# EAGLE design Adafruit RGB Matrix Shield (EAGLE 9.0.1)
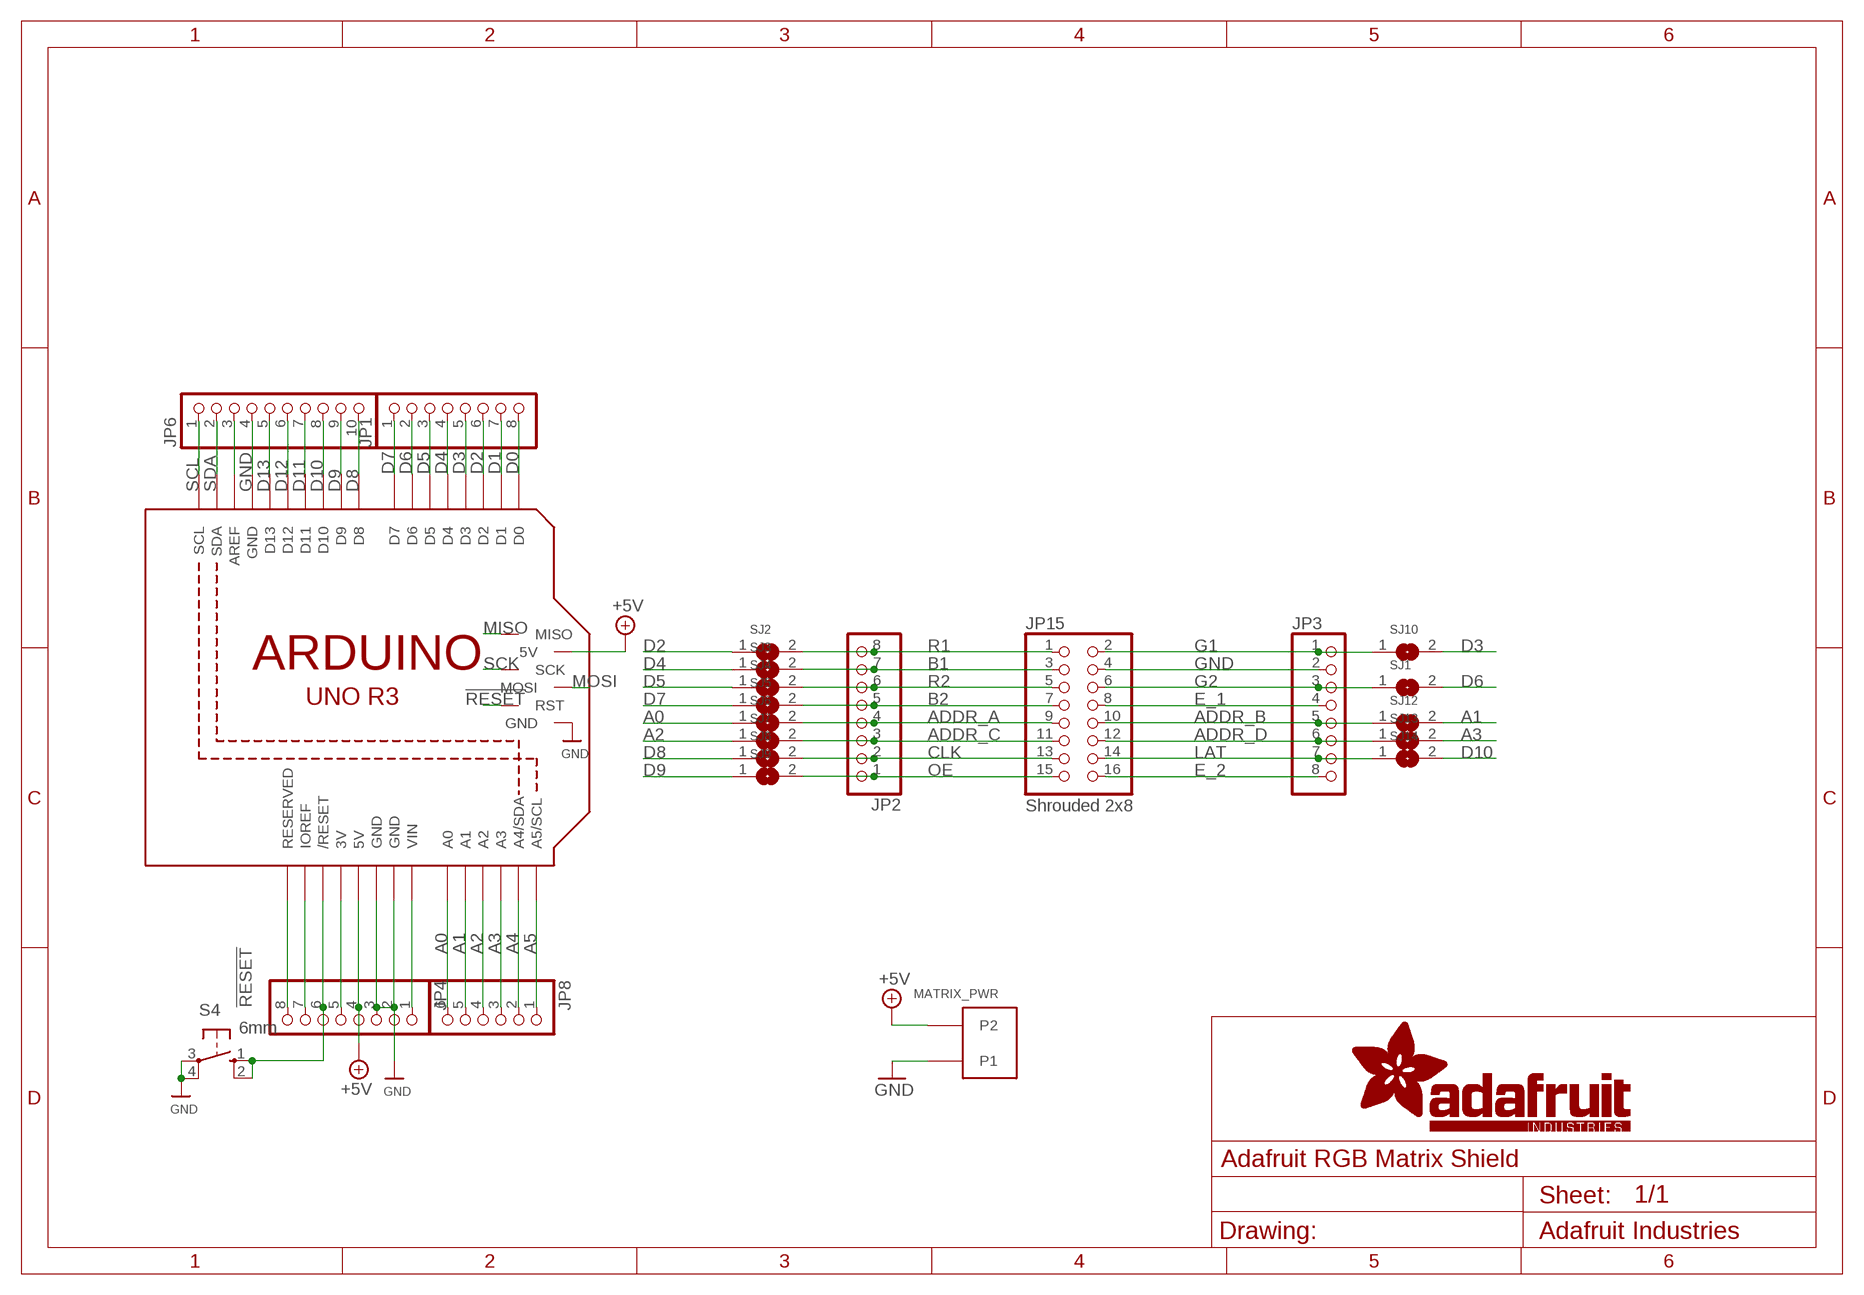
[diagram p0: schematic, sheet 1]

## Parts
JP1  PINHD-1X8CLEANBIG  [1X08-CLEANBIG]
JP2  HEADER-1X876MIL  [1X08_ROUND_76]
JP3  HEADER-1X876MIL  [1X08_ROUND_76]
JP4  PINHD-1X8CLEANBIG  [1X08-CLEANBIG]
JP6  HEADER-1X1070MIL  [1X10_ROUND70]
JP8  PINHD-1X6CB  [1X06-CLEANBIG]
JP15  Shrouded 2x8  HEADER-2X8_SHROUDED  [2X08_SHROUDED]
MATRIX_PWR  PINHEAD  [TERMBLOCK508]
S4  6mm  10-XX  [B3F-10XX]
SJ1  SOLDERJUMPERCLOSED  [SOLDERJUMPER_CLOSEDWIRE]
SJ2  SOLDERJUMPERCLOSED  [SOLDERJUMPER_CLOSEDWIRE]
SJ3  SOLDERJUMPERCLOSED  [SOLDERJUMPER_CLOSEDWIRE]
SJ4  SOLDERJUMPERCLOSED  [SOLDERJUMPER_CLOSEDWIRE]
SJ5  SOLDERJUMPERCLOSED  [SOLDERJUMPER_CLOSEDWIRE]
SJ6  SOLDERJUMPERCLOSED  [SOLDERJUMPER_CLOSEDWIRE]
SJ7  SOLDERJUMPERCLOSED  [SOLDERJUMPER_CLOSEDWIRE]
SJ8  SOLDERJUMPERCLOSED  [SOLDERJUMPER_CLOSEDWIRE]
SJ9  SOLDERJUMPERCLOSED  [SOLDERJUMPER_CLOSEDWIRE]
SJ10  SOLDERJUMPERCLOSED  [SOLDERJUMPER_CLOSEDWIRE]
SJ12  SOLDERJUMPERCLOSED  [SOLDERJUMPER_CLOSEDWIRE]
SJ13  SOLDERJUMPERCLOSED  [SOLDERJUMPER_CLOSEDWIRE]
SJ14  SOLDERJUMPERCLOSED  [SOLDERJUMPER_CLOSEDWIRE]
U$41  ARDUINO_R3_ICSP_NODIM  [ARDUINOR3_ICSP_NODIM]

## Nets
!RESET: JP4.6 S4.1(S) S4.2(S1) U$41.RESET(/RESET) U$41.RESET_ICSP(RST)
+3V: JP4.5 U$41.3V
+5V: JP4.4 MATRIX_PWR.P$4(P2) U$41.5V U$41.5V_ICSP(5V)
A0: JP8.6 SJ6.1 U$41.A0
A1: JP8.5 SJ12.2 U$41.A1
A2: JP8.4 SJ7.1 U$41.A2
A3: JP8.3 SJ13.2 U$41.A3
A4: JP8.2 U$41.A4(A4/SDA)
A5: JP8.1 U$41.A5(A5/SCL)
ADDR_A: JP2.4 JP15.9 SJ6.2
ADDR_B: JP3.5 JP15.10 SJ12.1
ADDR_C: JP2.3 JP15.11 SJ7.2
ADDR_D: JP3.6 JP15.12 SJ13.1
AREF: JP6.3 U$41.AREF
B1: JP2.7 JP15.3 SJ3.2
B2: JP2.5 JP15.7 SJ5.2
CLK: JP2.2 JP15.13 SJ8.2
D0: JP1.8 U$41.D0
D1: JP1.7 U$41.D1
D2: JP1.6 SJ2.1 U$41.D2
D3: JP1.5 SJ10.2 U$41.D3
D4: JP1.4 SJ3.1 U$41.D4
D5: JP1.3 SJ4.1 U$41.D5
D6: JP1.2 SJ1.2 U$41.D6
D7: JP1.1 SJ5.1 U$41.D7
D8: JP6.10 SJ8.1 U$41.D8
D9: JP6.9 SJ9.1 U$41.D9
D10: JP6.8 SJ14.2 U$41.D10
D11: JP6.7 U$41.D11
D12: JP6.6 U$41.D12
D13: JP6.5 U$41.D13
E_1: JP3.4 JP15.8
E_2: JP3.8 JP15.16
G1: JP3.1 JP15.2 SJ10.1
G2: JP3.3 JP15.6 SJ1.1
GND: JP3.2 JP4.2 JP4.3 JP6.4 JP15.4 MATRIX_PWR.P$3(P1) S4.3(P) S4.4(P1) U$41.GND U$41.GND@1(GND) U$41.GND@2(GND) U$41.GND@3(GND)
IOREF: JP4.7 U$41.IOREF
LAT: JP3.7 JP15.14 SJ14.1
MISO: U$41.MISO
MOSI: U$41.MOSI
NC: JP4.8 U$41.RESERVED
OE: JP2.1 JP15.15 SJ9.2
R1: JP2.8 JP15.1 SJ2.2
R2: JP2.6 JP15.5 SJ4.2
SCK: U$41.SCK
SCL: JP6.1 U$41.SCL
SDA: JP6.2 U$41.SDA
VIN: JP4.1 U$41.VIN

## Library data of the parts
JP1 JP4 = adafruit:PINHD-1X8: PIN HEADER
JP2 JP3 = microbuilder:HEADER-1X8: PIN HEADER
JP6 = microbuilder:HEADER-1X10: PIN HEADER
JP8 = adafruit:PINHD-1X6: PIN HEADER
JP15 = microbuilder:HEADER-2X8
MATRIX_PWR = mshield:PINHEAD
S4 = switch-omron:10-XX: OMRON SWITCH; MPN: B3F-1000; OC_FARNELL: 176432; OC_NEWARK: 36M3542
SJ1-SJ10 SJ12-SJ14 = microbuilder:SOLDERJUMPER: SMD Solder JUMPER Solder the two pads together to create a connection, or remove the solder to break it. REFLOW - Use this footprint for solder paste and reflow ovens. WAVE - Use this footprint for hand-soldering (larger pads). CLOSED - Has a trace between the two pads to ensure it is closed by default. The trace needs to be cut to disable the jumper, and can be closed again by creating a solder bridge between the two pads.
U$41 = adafruit:ARDUINO_R3_ICSP

## Board
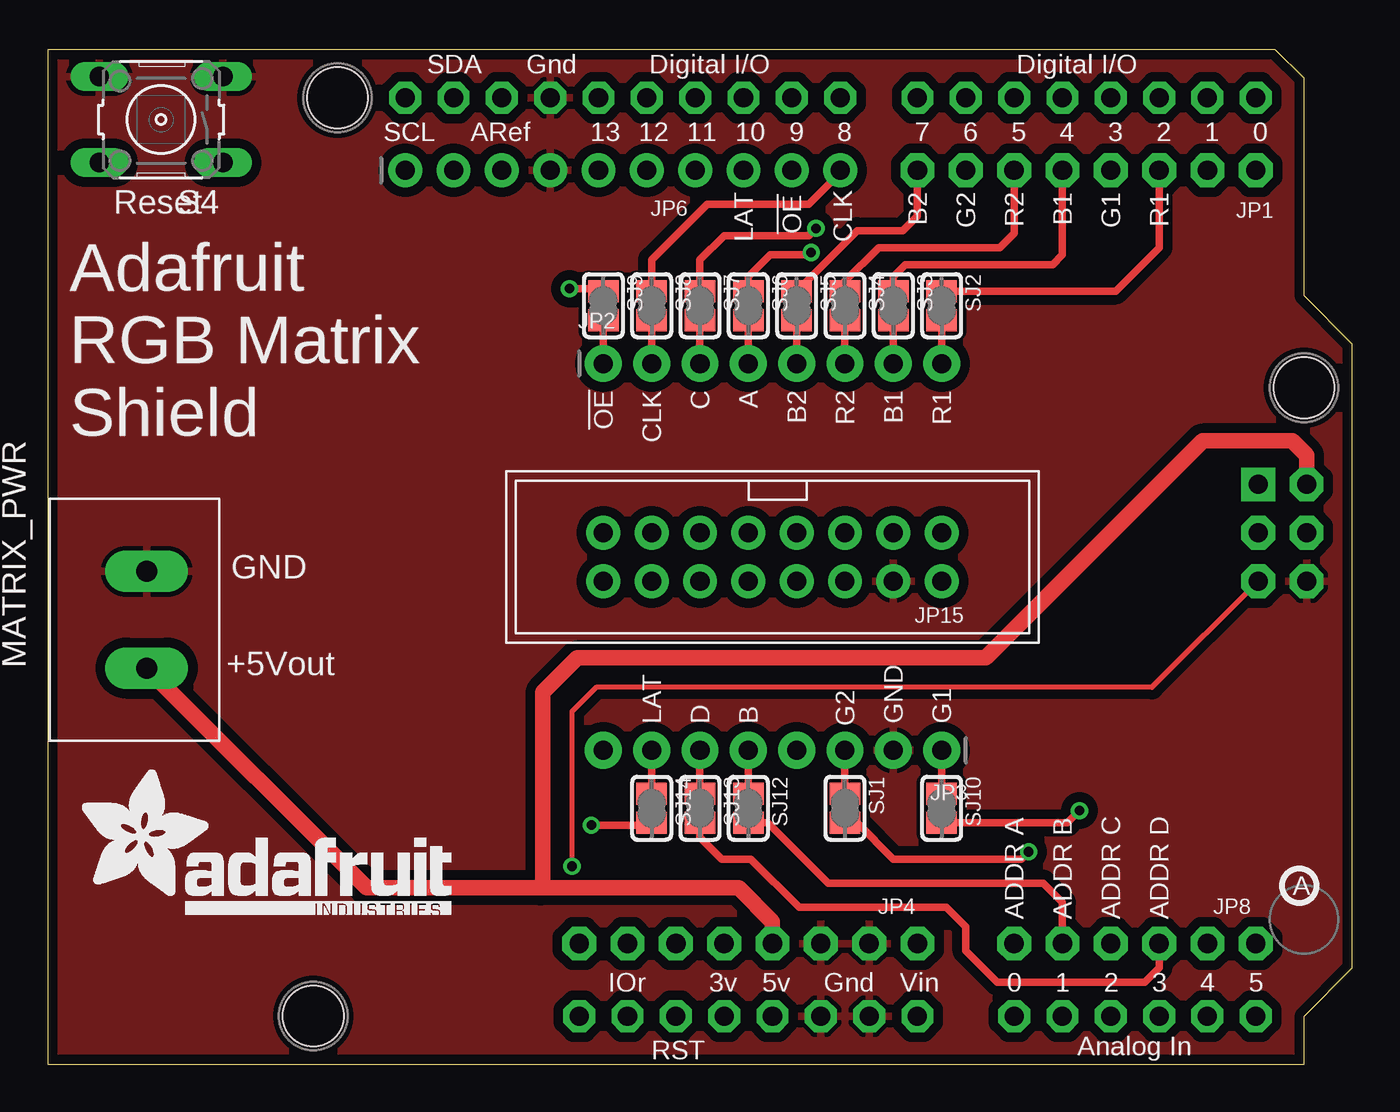
[diagram p1: board, top side]
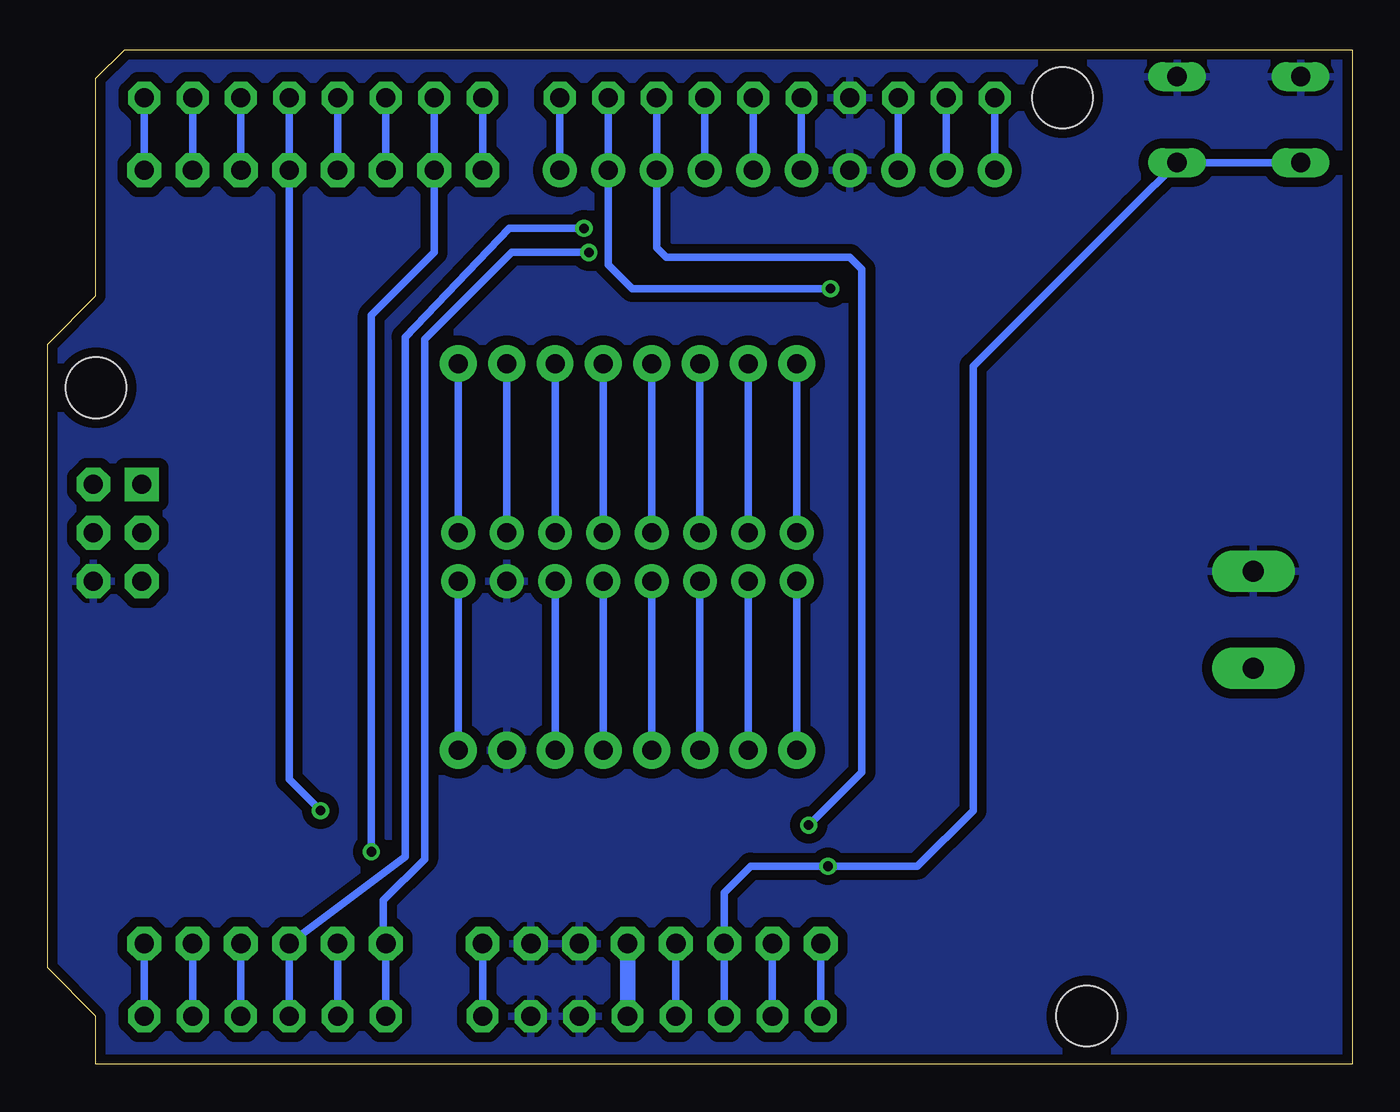
[diagram p2: board, bottom side, seen from below]

Size 68.58 x 53.34 mm. Coordinates in mm from the lower left corner, seen from the top.
Outline: 0,0 66.04,0 66.04,2.54 68.58,5.08 68.58,37.85 66.04,40.39 66.04,51.82 64.52,53.34 0,53.34 0,0
Copper layers (1*16): Top 0.035mm / dielectric 1.5mm / Bottom 0.035mm
Design rules "adafruit *": minimum track width 7mil, minimum drill 15.5mil, track to track 7mil, track to pad 7mil, pad to pad 7mil, via to via 7mil, smd to smd 7mil, copper to edge 10mil, drill to drill 8mil, minimum pad ring 10mil, minimum via ring 8mil, stop-mask expansion 2mil, vias tented up to drill 20mil, thermal gap 10mil
Holes 3.2 mm at 15.24,50.8 13.97,2.54 66.04,35.56

### Footprints (pad centres in the part's own frame; a part is rotated, then mirrored left to right if it is on the bottom)
1X08-CLEANBIG = drill 1.016 pad 1.778 octagon: 1 -8.89,0; 2 -6.35,0; 3 -3.81,0; 4 -1.27,0; 5 1.27,0; 6 3.81,0; 7 6.35,0; 8 8.89,0
1X08_ROUND_76 = drill 1 pad 1.93: 1 -8.89,0; 2 -6.35,0; 3 -3.81,0; 4 -1.27,0; 5 1.27,0; 6 3.81,0; 7 6.35,0; 8 8.89,0
1X10_ROUND70 = drill 1 pad 1.778: 1 -11.43,0; 2 -8.89,0; 3 -6.35,0; 4 -3.81,0; 5 -1.27,0; 6 1.27,0; 7 3.81,0; 8 6.35,0; 9 8.89,0; 10 11.43,0
1X06-CLEANBIG = drill 1.016 pad 1.778 octagon: 1 -6.35,0; 2 -3.81,0; 3 -1.27,0; 4 1.27,0; 5 3.81,0; 6 6.35,0
2X08_SHROUDED = drill 1 pad 1.778: 1 -8.89,-1.27; 2 -8.89,1.27; 3 -6.35,-1.27; 4 -6.35,1.27; 5 -3.81,-1.27; 6 -3.81,1.27; 7 -1.27,-1.27; 8 -1.27,1.27; 9 1.27,-1.27; 10 1.27,1.27; 11 3.81,-1.27; 12 3.81,1.27; 13 6.35,-1.27; 14 6.35,1.27; 15 8.89,-1.27; 16 8.89,1.27
TERMBLOCK508 = drill 1.1 pad 2.184 long: P$3 -2.54,0; P$4 2.54,0
B3F-10XX = drill 1.016 long: 1 -3.251,2.261; 2 3.251,2.261; 3 -3.251,-2.261; 4 3.251,-2.261
SOLDERJUMPER_CLOSEDWIRE = smd 1.168 x 1.6: 1 -0.762,0; 2 0.762,0 | smd 0.635 x 0.203: WIRE 0,0
ARDUINOR3_ICSP_NODIM = drill 1 pad 1.676 octagon: 3V 35.56,2.54; 5V 38.1,2.54; A0 50.8,2.54; A1 53.34,2.54; A2 55.88,2.54; A3 58.42,2.54; A4 60.96,2.54; A5 63.5,2.54; AREF 23.876,50.8; D0 63.5,50.8; D1 60.96,50.8; D2 58.42,50.8; D3 55.88,50.8; D4 53.34,50.8; D5 50.8,50.8; D6 48.26,50.8; D7 45.72,50.8; D8 41.656,50.8; D9 39.116,50.8; D10 36.576,50.8; D11 34.036,50.8; D12 31.496,50.8; D13 28.956,50.8; GND 26.416,50.8; GND@1 43.18,2.54; GND@2 40.64,2.54; IOREF 30.48,2.54; RESERVED 27.94,2.54; RESET 33.02,2.54; SCL 18.796,50.8; SDA 21.336,50.8; VIN 45.72,2.54 | drill 1 pad 1.778 octagon: 5V_ICSP 66.167,30.48; GND@3 66.167,25.4; MOSI 66.167,27.94; RESET_ICSP 63.627,25.4; SCK 63.627,27.94 | drill 1 pad 1.778 square: MISO 63.627,30.48

### Placement (x,y rotation side)
JP1  54.61,46.99 0 top
JP2  38.1,36.83 0 top
JP3  38.1,16.51 180 top
JP4  36.83,6.35 180 top
JP6  30.23,46.99 0 top
JP8  57.15,6.35 180 top
JP15  38.1,26.67 180 top
MATRIX_PWR  5.21,23.37 270 top
S4  5.97,49.66 180 top
SJ1  41.91,13.46 270 top
SJ2  46.99,39.88 270 top
SJ3  44.45,39.88 270 top
SJ4  41.91,39.88 270 top
SJ5  39.37,39.88 270 top
SJ6  36.83,39.88 270 top
SJ7  34.29,39.88 270 top
SJ8  31.75,39.88 270 top
SJ9  29.21,39.88 270 top
SJ10  46.99,13.46 270 top
SJ12  36.83,13.46 270 top
SJ13  34.29,13.46 270 top
SJ14  31.75,13.46 270 top
U$8  [PCBFEAT-REV-040]  65.79,9.4 0 top
U$9  [ADAFRUIT_TEXT_20MM]  1.65,7.87 0 top
U$41  0,0 0 top

### Tracks (layer width: path | path; a pad name or v marks a point on that pad's centre or on a via)
!RESET  (via drill 0.5)
  Top 0.254: U$41.RESET_ICSP 58.04,19.81 28.83,19.81 27.56,18.54 v27.56,10.41
  Bottom 0.406: U$41.RESET JP4.6 33.02,9.02 31.62,10.41 v27.56,10.41 22.86,10.41 19.94,13.34 19.94,36.7 11.56,45.09 9.25,47.37 S4.1 S4.2
+3V
  Bottom 0.406: U$41.3V JP4.5
+5V
  Top 0.813: JP4.4 38.1,7.49 36.32,9.27 25.91,9.27 | 25.91,9.27 16.76,9.27 MATRIX_PWR.P$4 | U$41.5V_ICSP 66.17,32 65.41,32.77 60.71,32.77 49.3,21.36 27.84,21.36 26.04,19.56 26.04,9.4 25.91,9.27
  Bottom 0.813: JP4.4 U$41.5V
A0  (via drill 0.5)
  Top 0.406: SJ6.1 36.83,41.4 37.97,42.55 40.01,42.55 v40.13,42.67
  Bottom 0.406: U$41.A0 JP8.6 50.93,6.48 50.93,8.64 48.77,10.79 48.77,38.1 44.2,42.67 v40.13,42.67
A1
  Top 0.406: JP8.5 53.34,8.51 52.32,9.53 41.02,9.53 37.85,12.7 SJ12.2
  Bottom 0.406: JP8.5 U$41.A1
A2  (via drill 0.5)
  Top 0.406: SJ7.1 34.29,42.29 35.56,43.56 40.01,43.56 v40.39,43.94
  Bottom 0.406: U$41.A2 JP8.4 49.78,10.92 49.78,38.23 44.32,43.94 v40.39,43.94
A3
  Top 0.406: JP8.3 58.42,5.08 57.66,4.32 49.91,4.32 48.26,5.97 48.26,7.24 47.24,8.26 39.5,8.26 36.96,10.79 35.43,10.79 34.29,11.94 SJ13.2
  Bottom 0.406: JP8.3 U$41.A3
A4
  Bottom 0.406: U$41.A4 JP8.2
A5
  Bottom 0.406: JP8.1 U$41.A5
ADDR_A
  Top 0.406: SJ6.2 JP2.4
  Bottom 0.406: JP15.9 JP2.4
ADDR_B
  Top 0.406: SJ12.1 JP3.5
  Bottom 0.406: JP15.10 JP3.5
ADDR_C
  Top 0.406: SJ7.2 JP2.3
  Bottom 0.406: JP15.11 JP2.3
ADDR_D
  Top 0.406: SJ13.1 JP3.6
  Bottom 0.406: JP15.12 JP3.6
AREF
  Bottom 0.406: U$41.AREF JP6.3
B1
  Top 0.406: JP2.7 SJ3.2
  Bottom 0.406: JP2.7 JP15.3
B2
  Top 0.406: SJ5.2 JP2.5
  Bottom 0.406: JP2.5 JP15.7
CLK
  Top 0.406: SJ8.2 JP2.2
  Bottom 0.406: JP15.13 JP2.2
D0
  Bottom 0.406: U$41.D0 JP1.8
D1
  Bottom 0.406: U$41.D1 JP1.7
D2
  Top 0.406: SJ2.1 56.13,40.64 58.42,42.93 JP1.6
  Bottom 0.406: U$41.D2 JP1.6
D3  (via drill 0.5)
  Top 0.406: SJ10.2 53.59,12.7 v54.23,13.34
  Bottom 0.406: U$41.D3 JP1.5 55.88,14.99 v54.23,13.34
D4
  Top 0.406: SJ3.1 44.45,41.4 45.09,42.04 52.83,42.04 53.34,42.55 JP1.4
  Bottom 0.406: U$41.D4 JP1.4
D5
  Top 0.406: SJ4.1 41.91,41.15 43.69,42.93 50.04,42.93 50.8,43.69 JP1.3
  Bottom 0.406: U$41.D5 JP1.3
D6  (via drill 0.5)
  Top 0.406: SJ1.2 42.55,12.7 44.45,10.79 51.18,10.79 v51.56,11.18
  Bottom 0.406: U$41.D6 JP1.2 48.26,42.67 51.56,39.37 v51.56,11.18
D7
  Top 0.406: SJ5.1 42.55,43.81 44.96,43.81 45.72,44.58 JP1.1
  Bottom 0.406: U$41.D7 JP1.1
D8
  Top 0.406: SJ8.1 31.75,42.29 34.67,45.21 40.01,45.21 41.66,46.86 JP6.10
  Bottom 0.406: U$41.D8 JP6.10
D9  (via drill 0.5)
  Top 0.406: SJ9.1 29.08,40.77 v27.43,40.77
  Bottom 0.406: U$41.D9 JP6.9 39.12,42.04 37.85,40.77 v27.43,40.77
D10  (via drill 0.5)
  Top 0.406: v28.57,12.57 31.62,12.57 SJ14.2
  Bottom 0.406: U$41.D10 JP6.8 36.58,42.93 36.07,42.42 26.42,42.42 25.78,41.78 25.78,15.37 v28.57,12.57
D11
  Bottom 0.406: U$41.D11 JP6.7
D12
  Bottom 0.406: U$41.D12 JP6.6
D13
  Bottom 0.406: U$41.D13 JP6.5
E_1
  Bottom 0.406: JP15.8 JP3.4
E_2
  Bottom 0.406: JP15.16 JP3.8
G1
  Top 0.406: SJ10.1 JP3.1
  Bottom 0.406: JP15.2 JP3.1
G2
  Top 0.406: SJ1.1 JP3.3
  Bottom 0.406: JP15.6 JP3.3
GND
  Top 0.406: 66.04,25.27 U$41.GND@3
  Bottom 0.406: 43.05,6.48 JP4.2
  pour Bottom (isolate 0.508): 0,53.34 68.58,53.34 68.58,0 0,0
  pour Top (isolate 0.508): 0,53.34 68.58,53.34 68.58,0 0,0
IOREF
  Bottom 0.406: U$41.IOREF JP4.7
LAT
  Top 0.406: SJ14.1 JP3.7
  Bottom 0.406: JP15.14 JP3.7
NC
  Bottom 0.406: JP4.8 U$41.RESERVED
OE
  Top 0.406: SJ9.2 JP2.1
  Bottom 0.406: JP15.15 JP2.1
R1
  Top 0.406: SJ2.2 JP2.8
  Bottom 0.406: JP15.1 JP2.8
R2
  Top 0.406: SJ4.2 JP2.6
  Bottom 0.406: JP15.5 JP2.6
SCL
  Bottom 0.406: U$41.SCL JP6.1
SDA
  Bottom 0.406: JP6.2 U$41.SDA
VIN
  Bottom 0.406: JP4.1 U$41.VIN

### Text on the board
tPlace: Reset | LAT | !OE | CLK | B2 | G2 | R2 | B1 | G1 | R1 | !OE | CLK | C | A | B2 | R2 | B1 | R1 | Adafruit / RGB Matrix / Shield | GND | +5Vout | LAT | D | B | G2 | GND | G1 | ADDR A | ADDR B | ADDR C | ADDR D